# Altium schematic sheet blocks.SchDoc
size A4
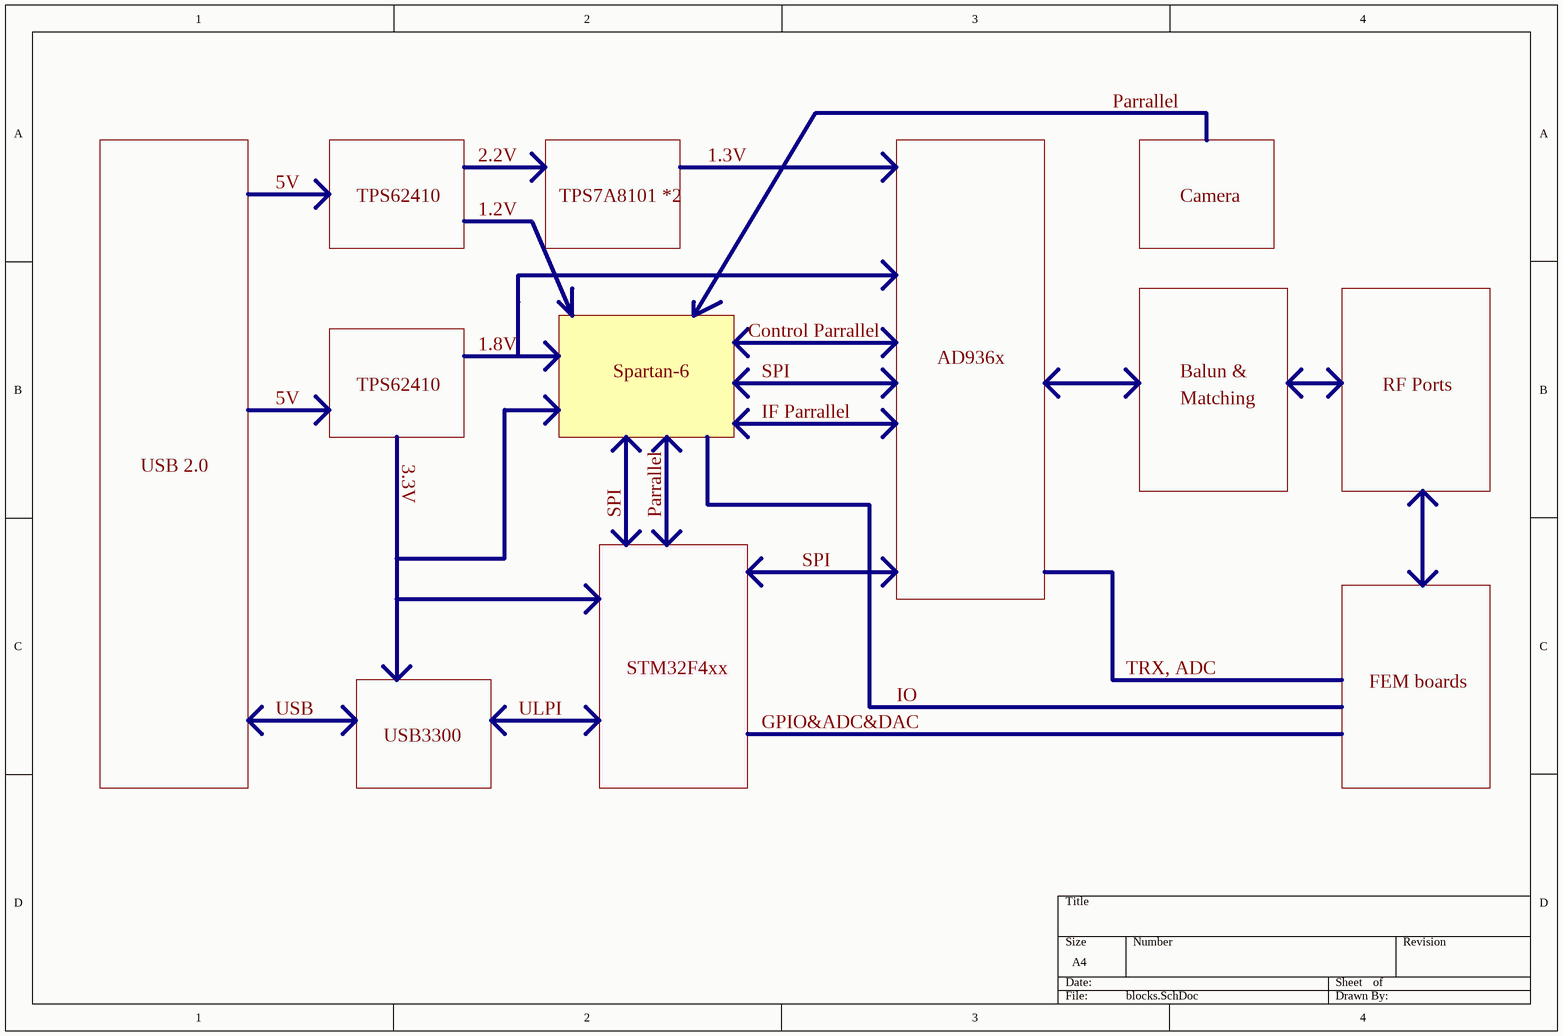
[diagram p0: blocks.SchDoc]

## Notes on the sheet
- Parrallel
- 2.2V
- 1.3V
- 5V
- TPS62410
- 1.2V
- TPS7A8101 *2
- Camera
- 1.8V
- Spartan-6
- Control Parrallel
- SPI
- AD936x
- Balun &
- IF Parrallel
- Matching
- RF Ports
- USB 2.0
- 3.3V
- USB
- ULPI
- STM32F4xx
- IO
- TRX, ADC
- FEM boards
- USB3300
- GPIO&ADC&DAC